# Altium schematic sheet FPGA_Memec_CoolRunner_XPLA3_Demo_Board.SchDoc: Example for the CoolRunner XPLA3 Board
size B; Organization: Altium Limited; Address1: L3, 12a Rodborough Rd; Address2: Frenchs Forest; Address3: NSW; Address4: Australia 2086; DocumentNumber: 1; SheetNumber: 1; SheetTotal: 2
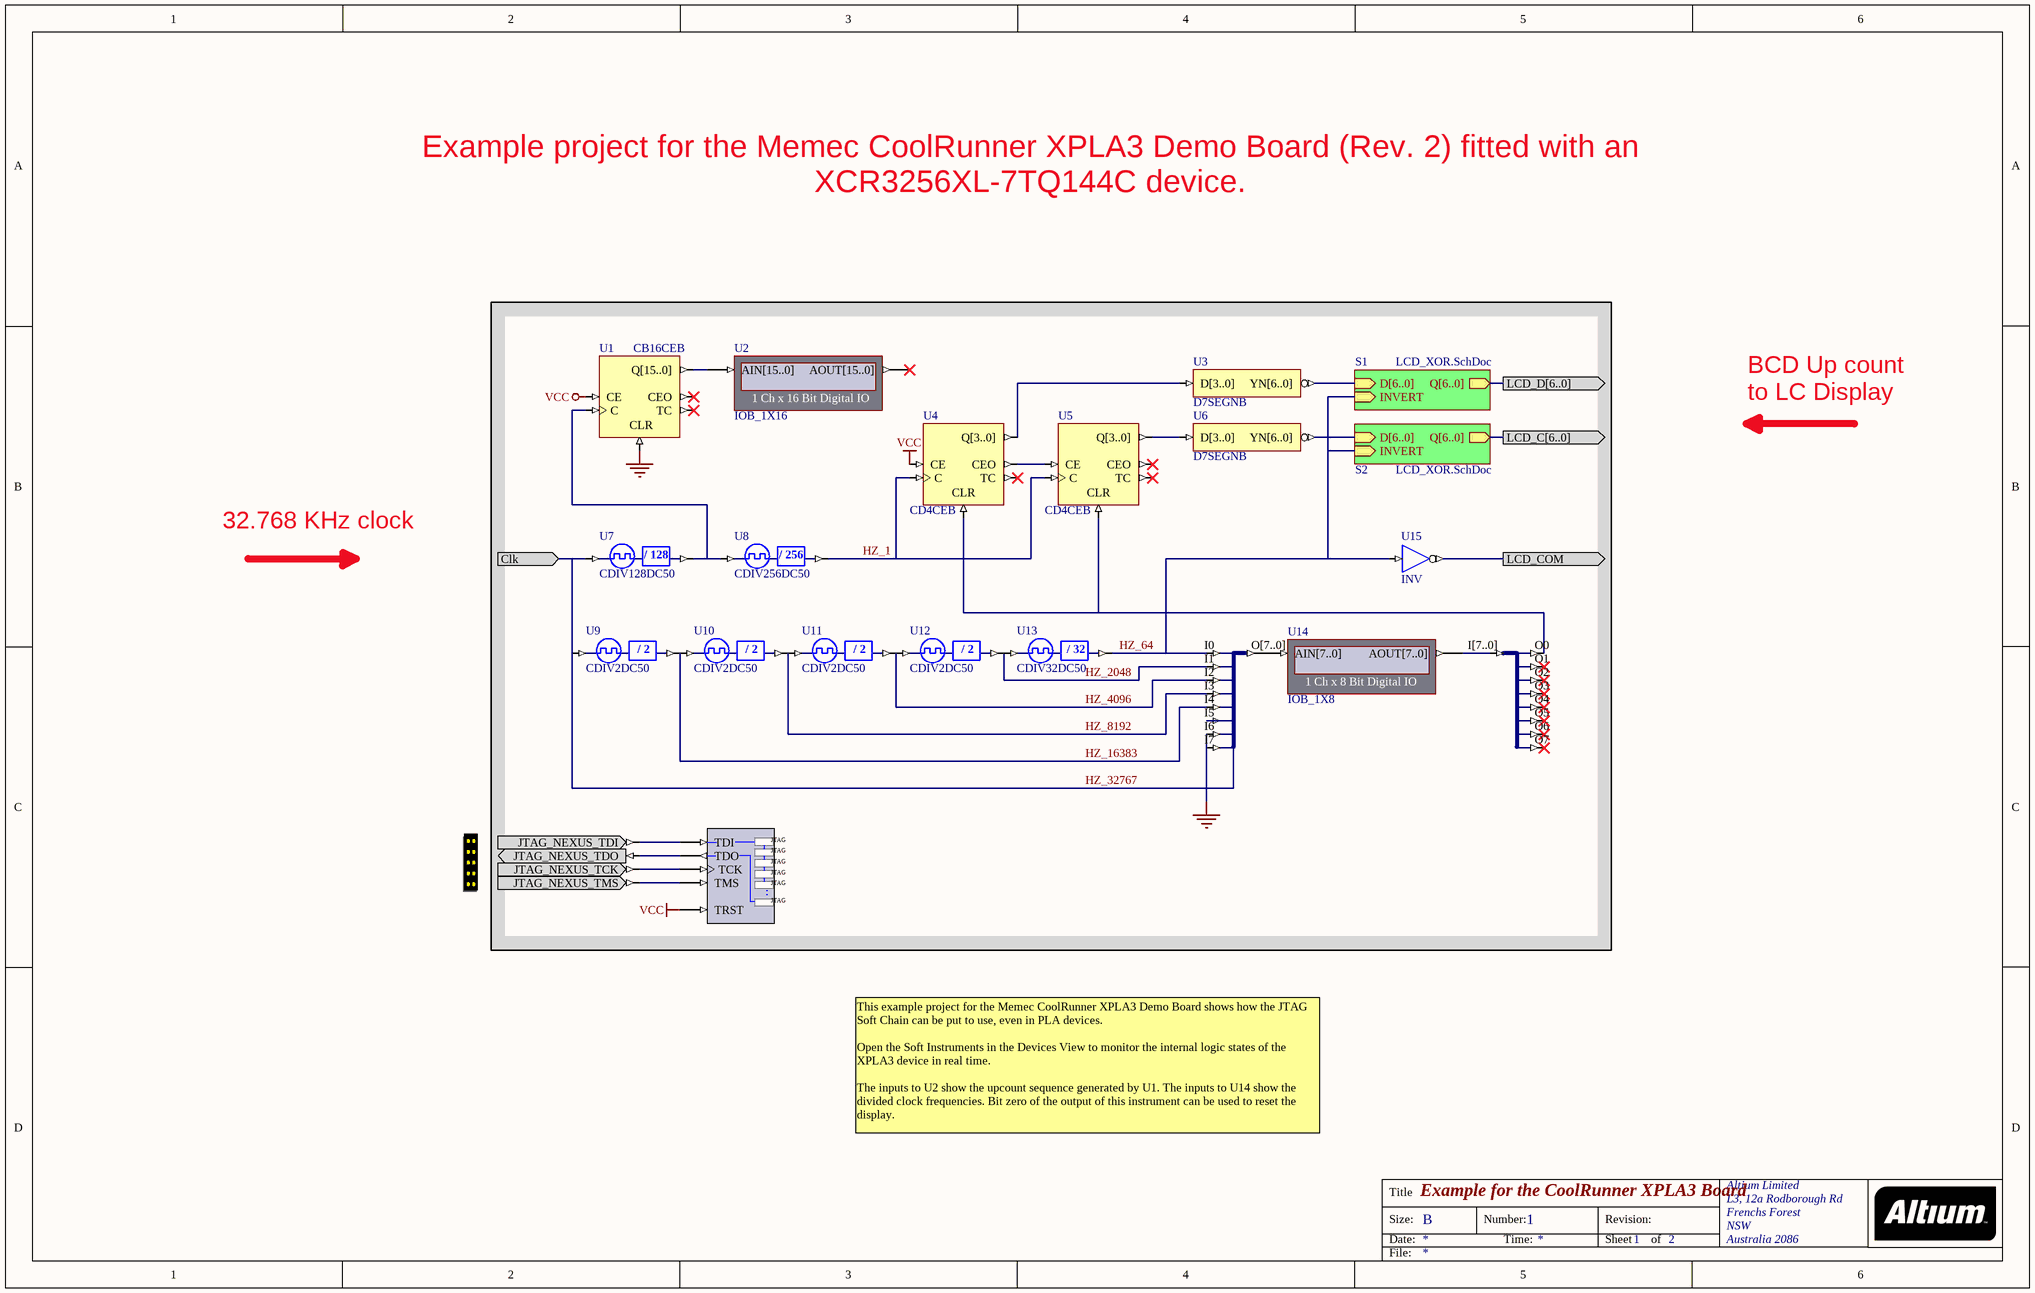
[diagram p0: FPGA_Memec_CoolRunner_XPLA3_Demo_Board.SchDoc]

## Parts
?  NEXUS_JTAG_CONNECTOR  (value not drawn)
NEXUS_JTAG_PORT  NEXUS_JTAG_PORT  (value not drawn)
U1  CB16CEB
U2  IOB_1X16
U3  D7SEGNB
U4  CD4CEB
U5  CD4CEB
U6  D7SEGNB
U7  CDIV128DC50
U8  CDIV256DC50
U9  CDIV2DC50
U10  CDIV2DC50
U11  CDIV2DC50
U12  CDIV2DC50
U13  CDIV32DC50
U14  IOB_1X8
U15  INV
U16  J8S_8B  (value not drawn)
U17  J8B_8S  (value not drawn)

## Sub-sheets
S1 = LCD_XOR.SchDoc: D[6..0] (in), Q[6..0] (out), INVERT (in)
S2 = LCD_XOR.SchDoc: D[6..0] (in), Q[6..0] (out), INVERT (in)

## Ports
Clk (in), LCD_C[6..0] (out), LCD_COM (out), LCD_D[6..0] (out)

## Nets
GND: U1.CLR U16.I6 U16.I7
VCC: NEXUS_JTAG_PORT.TRST U1.CE U4.CE
HZ_1: U4.C U5.C U8.CLKDV
HZ_64: U13.CLKDV U15.I U16.I0 ; sheet S1/INVERT, sheet S2/INVERT
HZ_2048: U12.CLKDV U13.CLKIN U16.I1
HZ_4096: U11.CLKDV U12.CLKIN U16.I2
HZ_8192: U10.CLKDV U11.CLKIN U16.I3
HZ_16383: U9.CLKDV U10.CLKIN U16.I4
HZ_32767: U7.CLKIN U9.CLKIN U16.I5 ; port Clk
LCD_COM: U15.O ; port LCD_COM
Net?_JTAG_NEXUS_TCK: ?.JTAG_NEXUS_TCK NEXUS_JTAG_PORT.TCK
Net?_JTAG_NEXUS_TDI: ?.JTAG_NEXUS_TDI NEXUS_JTAG_PORT.TDI
Net?_JTAG_NEXUS_TDO: ?.JTAG_NEXUS_TDO NEXUS_JTAG_PORT.TDO
Net?_JTAG_NEXUS_TMS: ?.JTAG_NEXUS_TMS NEXUS_JTAG_PORT.TMS
NetU1_C: U1.C U7.CLKDV U8.CLKIN
NetU1_Q[15..0]: U1.Q[15..0] U2.AIN[15..0]
NetU3_D[3..0]: U3.D[3..0] U4.Q[3..0]
NetU3_YN[6..0]: U3.YN[6..0] ; sheet S1/D[6..0]
NetU4_CEO: U4.CEO U5.CE
NetU4_CLR: U4.CLR U5.CLR U17.O0
NetU5_Q[3..0]: U5.Q[3..0] U6.D[3..0]
NetU6_YN[6..0]: U6.YN[6..0] ; sheet S2/D[6..0]
NetU14_AIN[7..0]: U14.AIN[7..0] U16.O[7..0]
NetU14_AOUT[7..0]: U14.AOUT[7..0] U17.I[7..0]

Not connected (* = marked no-connect by the designer): U1 CEO* TC*; U2 AOUT[15..0]*; U4 TC*; U5 CEO* TC*; U17 O1* O2* O3* O4* O5* O6* O7*

## Buses and harness runs
bus port LCD_C[6..0] = sheet S2/Q[6..0]
bus port LCD_D[6..0] = sheet S1/Q[6..0]

## Notes on the sheet
- Example project for the Memec CoolRunner XPLA3 Demo Board (Rev. 2) fitted with an XCR3256XL-7TQ144C device.
- BCD Up count to LC Display
- 32.768 KHz clock
- This example project for the Memec CoolRunner XPLA3 Demo Board shows how the JTAG Soft Chain can be put to use, even in PLA devices.
  Open the Soft Instruments in the Devices View to monitor the internal logic states of the XPLA3 device in real time.
  The inputs to U2 show the upcount sequence generated by U1. The inputs to U14 show the divided clock frequencies. Bit zero of the output of this instrument can be used to reset the display.
- Title
- Size:
- Date:
- B
- Number:
- Time:
- Revision:
- Sheet
- of
- File:
- (in symbol CDIV2DC50) / 2
- (in symbol CDIV32DC50) / 32
- (in symbol CDIV128DC50) / 128
- (in symbol CDIV256DC50) / 256
- (in symbol NEXUS_JTAG_PORT) JTAG; .

## Library data of the parts
? = NEXUS_JTAG_CONNECTOR: JTAG Port; PortComponent: True; Published: 19-Nov-2003; Publisher: Altium Limited
NEXUS_JTAG_PORT = NEXUS_JTAG_PORT: Nexus Processor JTAG Chain Connector; NEXUS_JTAG_CONNECTOR: True; Published: 18-Nov-2003; Publisher: Altium Limited
U1 = CB16CEB: 16-Bit Cascadable Binary Counters with Clock Enable and Asynchronous Clear, Bus Version; ArchiveName: GENERIC; XilinxEquivalent: CB16CE; ClockTrigger: Rising; Enable: High; PortSize: 16; VHDLIB_SIM: GENERIC_LIB; Published: 29-Jan-2004; Publisher: Altium Limited; LastRevisionNo: 1.00.00; HelpURL: CR0118 FPGA Generic Library Guide.pdf#page=127; FunctionalClass: Counter; SubClass: Binary; Reset: Asynchronous; PortType: Bus Version
U2 = IOB_1X16: 1 Ch x 16 Bit Digital IO; NEXUS_CORE: Instrument; NEXUS_JTAG_DEVICE: True; NEXUS_JTAG_ORDER: 0; Published: 3-Nov-2004; Publisher: Altium Limited; LastRevisionNo: 1.00.00; HelpURL: CR0102 IOB_x Digital IO Module.pdf#page=2
U3 U6 = D7SEGNB: 7-Segment-Display Decoder for Common-Anode LED (Active Low Output), Bus Version; ArchiveName: GENERIC; SubClass: 7SEGN; PortSize: 7; VHDLIB_SIM: GENERIC_LIB; Published: 29-Jan-2004; Publisher: Altium Limited; LastRevisionNo: 1.00.00; HelpURL: CR0118 FPGA Generic Library Guide.pdf#page=162; FunctionalClass: Decoder; PortStyle: Bus Version
U4 U5 = CD4CEB: Cascadable BCD Counter with Clock Enable and Asynchronous Clear, Bus Version; ArchiveName: GENERIC; ClockTrigger: Rising; Enable: High; PortSize: 4; VHDLIB_SIM: GENERIC_LIB; Published: 29-Jan-2004; Publisher: Altium Limited; LastRevisionNo: 1.00.00; HelpURL: CR0118 FPGA Generic Library Guide.pdf#page=137; FunctionalClass: Counter; SubClass: BCD; Reset: Asynchronous; PortType: Bus Version
U7 = CDIV128DC50: Clock Divider by 128 with 50% Duty Cycle Output; ArchiveName: GENERIC; DivisorRate: 128; DutyCycle: 50; VHDLIB_SIM: GENERIC_LIB; Published: 29-Jan-2004; Publisher: Altium Limited; LastRevisionNo: 1.00.00; HelpURL: CR0118 FPGA Generic Library Guide.pdf#page=142; FunctionalClass: Clock Divider
U8 = CDIV256DC50: Clock Divider by 256 with 50% Duty Cycle Output; ArchiveName: GENERIC; DivisorRate: 256; DutyCycle: 50; VHDLIB_SIM: GENERIC_LIB; Published: 29-Jan-2004; Publisher: Altium Limited; LastRevisionNo: 1.00.00; HelpURL: CR0118 FPGA Generic Library Guide.pdf#page=142; FunctionalClass: Clock Divider
U9-U12 = CDIV2DC50: Clock Divider by 2 with 50% Duty Cycle Output; ArchiveName: GENERIC; XilinxEquivalent: CLK_DIV2; DivisorRate: 2; DutyCycle: 50; VHDLIB_SIM: GENERIC_LIB; Published: 29-Jan-2004; Publisher: Altium Limited; LastRevisionNo: 1.00.00; HelpURL: CR0118 FPGA Generic Library Guide.pdf#page=142; FunctionalClass: Clock Divider
U13 = CDIV32DC50: Clock Divider by 32 with 50% Duty Cycle Output; DivisorRate: 32; DutyCycle: 50; ArchiveName: GENERIC; VHDLIB_SIM: GENERIC_LIB; Published: 29-Jan-2004; Publisher: Altium Limited; LastRevisionNo: 1.00.00; HelpURL: CR0118 FPGA Generic Library Guide.pdf#page=142; FunctionalClass: Clock Divider
U14 = IOB_1X8: 1 Ch x 8 Bit Digital IO; NEXUS_CORE: Instrument; NEXUS_JTAG_DEVICE: True; NEXUS_JTAG_ORDER: 0; Published: 3-Nov-2004; Publisher: Altium Limited; LastRevisionNo: 1.00.00; HelpURL: CR0102 IOB_x Digital IO Module.pdf#page=2
U15 = INV: Inverter; FunctionalClass: Logic Primitive; ArchiveName: GENERIC; VHDLIB_SIM: GENERIC_LIB; Published: 29-Jan-2004; Publisher: Altium Limited; XilinxEquivalent: INV; LastRevisionNo: 1.00.00; HelpURL: CR0118 FPGA Generic Library Guide.pdf#page=290; SubClass: INV
U16 = J8S_8B: 8 Single pin inputs to single 8-Bit output bus; ArchiveName: GENERIC; FunctionalClass: Bus Joiner; PortSize: 8; VHDLIB_SIM: GENERIC_LIB; Published: 29-Jan-2004; Publisher: Altium Limited; LastRevisionNo: 1.00.00; HelpURL: CR0118 FPGA Generic Library Guide.pdf#page=305
U17 = J8B_8S: 8-Bit input bus to 8 single pin outputs; ArchiveName: GENERIC; FunctionalClass: Bus Joiner; PortSize: 8; VHDLIB_SIM: GENERIC_LIB; Published: 29-Jan-2004; Publisher: Altium Limited; LastRevisionNo: 1.00.00; HelpURL: CR0118 FPGA Generic Library Guide.pdf#page=303